# EasyEDA schematic 立创.json
TITLE: mianban; REV: 0.2; Date: 2021-11-7; Sheet: 1/1; Drawn By: tntinminecraft; Company: mianban
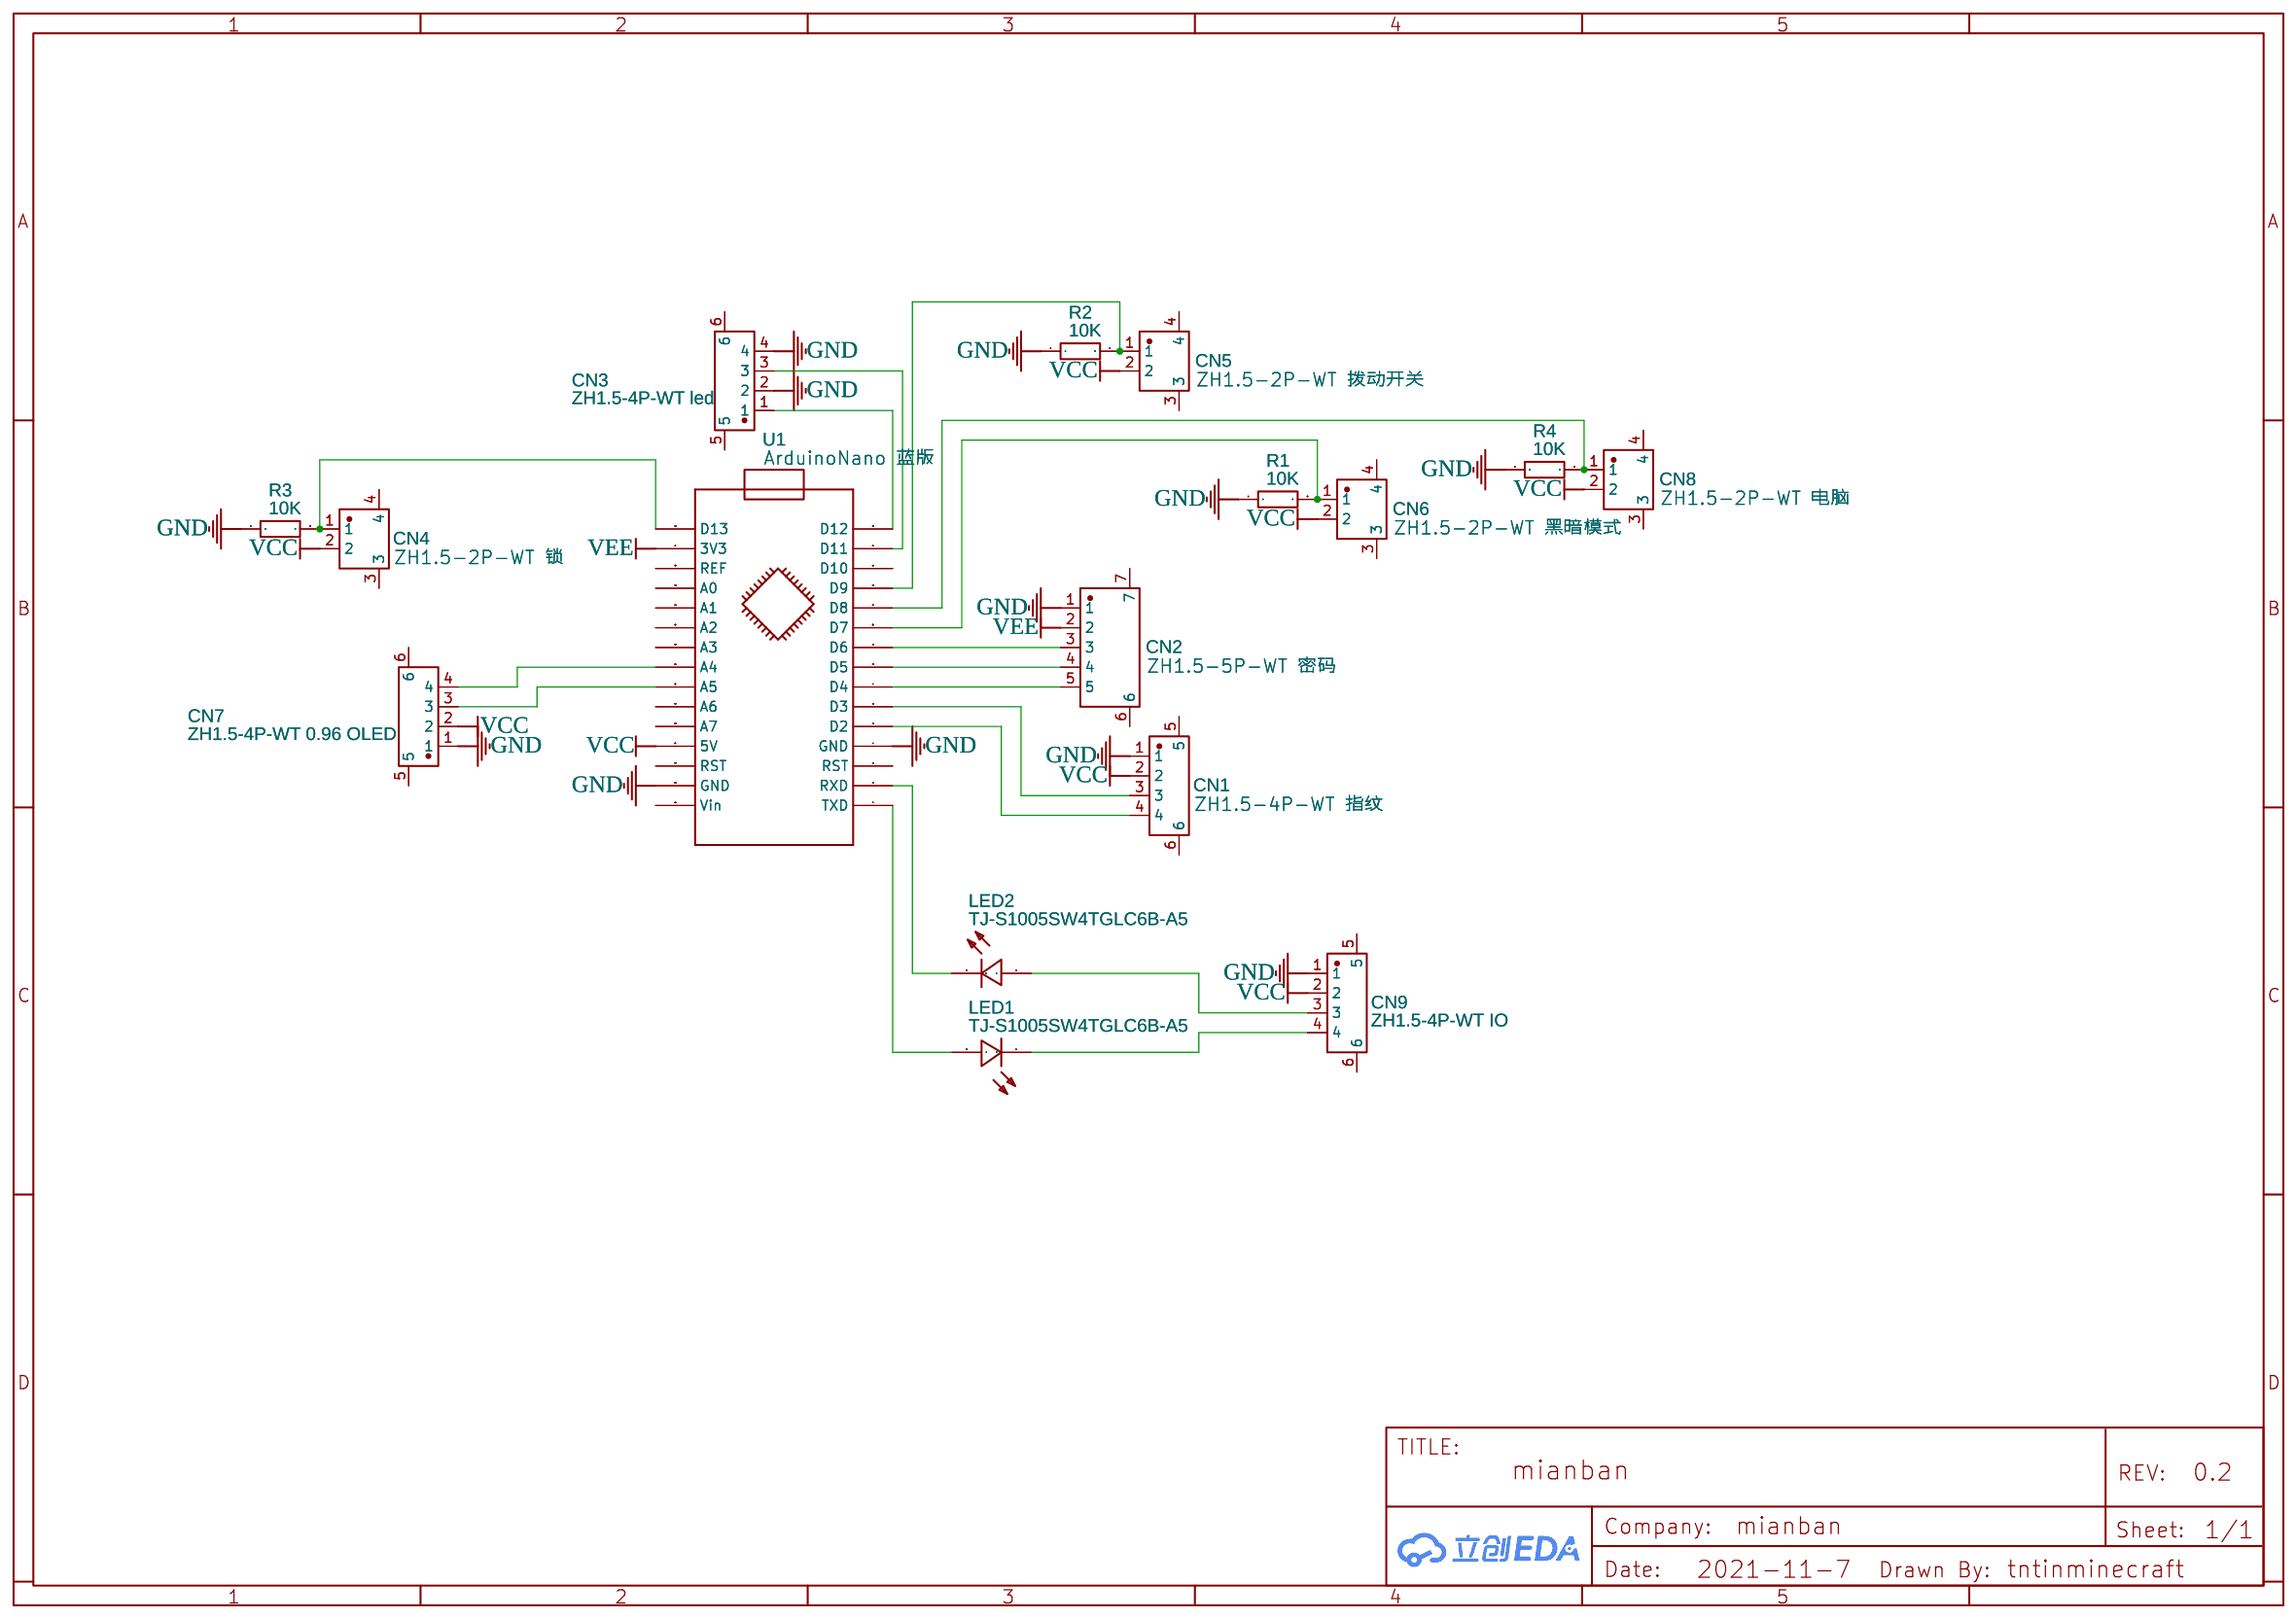
[diagram p0: schematic sheet]

## Parts
CN1  ZH1.5-4P-WT 指纹  [CONN-TH_ZH1.5-4P-WT]
CN2  ZH1.5-5P-WT 密码  [CONN-SMD_ZH1.5-5P-WT]
CN3  ZH1.5-4P-WT led  [CONN-TH_ZH1.5-4P-WT]
CN4  ZH1.5-2P-WT 锁  [CONN-SMD_ZH1.5-2P-WT]
CN5  ZH1.5-2P-WT 拨动开关  [CONN-SMD_ZH1.5-2P-WT]
CN6  ZH1.5-2P-WT 黑暗模式  [CONN-SMD_ZH1.5-2P-WT]
CN7  ZH1.5-4P-WT 0.96 OLED  [CONN-TH_ZH1.5-4P-WT]
CN8  ZH1.5-2P-WT 电脑  [CONN-SMD_ZH1.5-2P-WT]
CN9  ZH1.5-4P-WT IO  [CONN-TH_ZH1.5-4P-WT]
LED1  TJ-S1005SW4TGLC6B-A5  [LED0402-RD_BLUE]
LED2  TJ-S1005SW4TGLC6B-A5  [LED0402-RD_BLUE]
R1  10K  [R0603]
R2  10K  [R0603]
R3  10K  [R0603]
R4  10K  [R0603]
U1  ArduinoNano 蓝版  [ARDUINO NANO VINCENT]

## Library data of the parts
CN1 CN3 CN7 CN9 = ZH1.5-4P-WT: Supplier: LCSC; Supplier Part: C722921; Manufacturer: CAX(创都); Contributor: LCSC; JLCPCB Part Class: Extended Part
CN2 = ZH1.5-5P-WT: Supplier: LCSC; Supplier Part: C722925; Manufacturer: CAX; Contributor: LCSC; JLCPCB Part Class: Extended Part
CN4-CN6 CN8 = ZH1.5-2P-WT: Supplier: LCSC; Supplier Part: C722913; Manufacturer: CAX; Contributor: LCSC; JLCPCB Part Class: Extended Part
LED1 LED2 = TJ-S1005SW4TGLC6B-A5: Supplier: LCSC; Supplier Part: C273603; Manufacturer: TOGIALED; Contributor: LCSC; JLCPCB Part Class: Extended Part
R1-R4 = LE03WAJ0103T5E: Supplier: LCSC; Manufacturer: UniOhm; Supplier Part: C81087; JLCPCB Part Class: Extended Part
U1 = ArduinoNano 蓝版: Manufacturer Part: ArduinoNano; Contributor: Waikeonglau

## Nets
GND: CN1.1 CN2.1 CN3.2 CN3.4 CN7.1 CN9.1 R1.1 R2.1 R3.1 R4.1 U1.4(GND) U1.29(GND)
VCC: CN1.2 CN4.2 CN5.2 CN6.2 CN7.2 CN8.2 CN9.2 U1.27(5V)
VEE: CN2.2 U1.17(3V3)
Net-(CN1-3): CN1.3 U1.6(D3)
Net-(CN1-4): CN1.4 U1.5(D2)
Net-(CN2-3): CN2.3 U1.9(D6)
Net-(CN2-4): CN2.4 U1.8(D5)
Net-(CN2-5): CN2.5 U1.7(D4)
Net-(CN3-1): CN3.1 U1.15(D12)
Net-(CN3-3): CN3.3 U1.14(D11)
Net-(CN4-1): CN4.1 R3.2 U1.16(D13)
Net-(CN5-1): CN5.1 R2.2 U1.12(D9)
Net-(CN6-1): CN6.1 R1.2 U1.10(D7)
Net-(CN7-3): CN7.3 U1.24(A5)
Net-(CN7-4): CN7.4 U1.23(A4)
Net-(CN8-1): CN8.1 R4.2 U1.11(D8)
Net-(CN9-3): CN9.3 LED2.2(A)
Net-(CN9-4): CN9.4 LED1.1(C)
Net-(LED1-2): LED1.2(A) U1.1(TXD)
Net-(LED2-1): LED2.1(C) U1.2(RXD)

Not connected (* = marked no-connect by the designer): CN1 5 6; CN2 6 7; CN3 5 6; CN4 3 4; CN5 3 4; CN6 3 4; CN7 5 6; CN8 3 4; CN9 5 6; U1 3(RST) 13(D10) 18(REF) 19(A0) 20(A1) 21(A2) 22(A3) 25(A6) 26(A7) 28(RST) 30(Vin)
